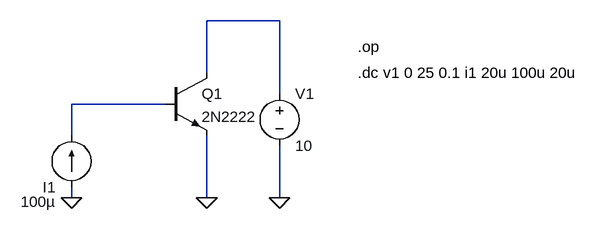
[diagram p0: schematic Problem 2 .asc]
Problem 2 .asc, the LTspice schematic file:
Version 4
SHEET 1 2308 1088
WIRE 1824 720 1712 720
WIRE 1712 800 1712 720
WIRE 1824 832 1824 720
WIRE 1648 848 1504 848
WIRE 1504 896 1504 848
WIRE 1504 992 1504 976
WIRE 1712 992 1712 896
WIRE 1824 992 1824 912
FLAG 1504 992 0
FLAG 1712 992 0
FLAG 1824 992 0
SYMBOL current 1504 976 R180
WINDOW 3 24 -22 Left 2
SYMATTR Value 100µ
SYMATTR InstName I1
SYMBOL voltage 1824 816 R0
SYMATTR InstName V1
SYMATTR Value 10
SYMBOL npn 1648 800 R0
SYMATTR InstName Q1
SYMATTR Value 2N2222
TEXT 1944 760 Left 2 !.op
TEXT 1944 800 Left 2 !.dc v1 0 25 0.1 i1 20u 100u 20u

The netlist it stands for:
* Problem 2 .asc
I1 0 N002 100µ
V1 N001 0 10
Q1 N001 N002 0 0 2N2222
.model NPN NPN
.model PNP PNP
.lib standard.bjt
.op
.dc v1 0 25 0.1 i1 20u 100u 20u
.backanno
.end